# Altium project LED Uygulamasi.PrjPcb
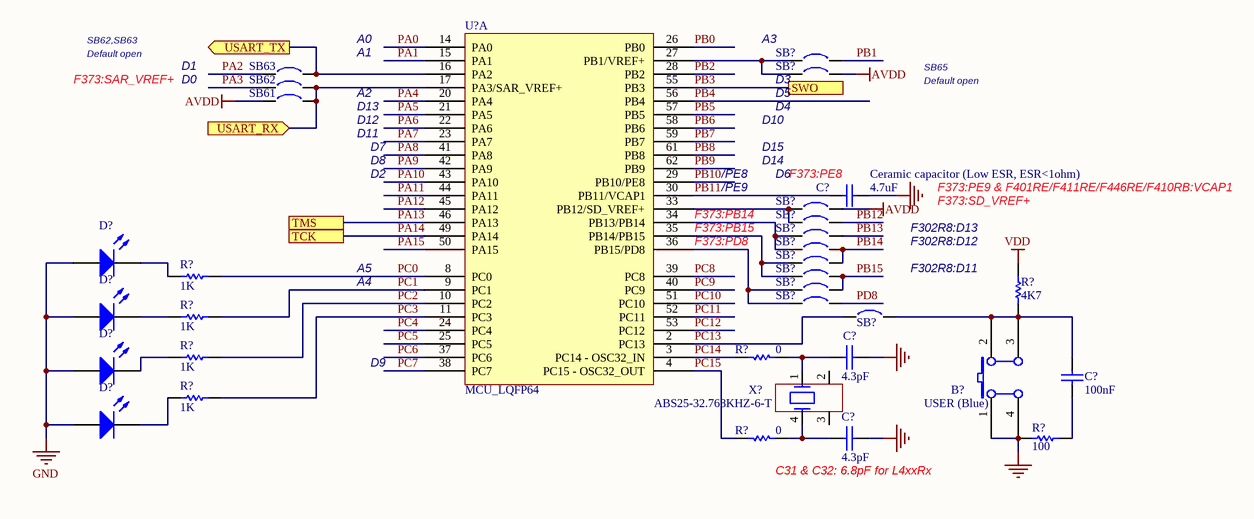
[diagram p0: Sheet1.SchDoc]
1 sheet, 33 parts. Net scope: flat (ports and power ports of the same name join across sheets).

## Sheet Sheet1.SchDoc
size A4; SheetNumber: 1; SheetTotal: 1

### Parts
(Parts that share a designator on the sheet are numbered #1, #2 ... from top to bottom, then left to right.)
B?  USER (Blue)  [PB10]
C?#1  4.7uF  [TAN-A]
C?#2  4.3pF  [0603C]
C?#3  100nF  [RAD-0.3]
C?#4  4.3pF  [0603C]
D?#1  Light-Emitting Diode  (value not drawn)
D?#2  Light-Emitting Diode  (value not drawn)
D?#3  Light-Emitting Diode  (value not drawn)
D?#4  Light-Emitting Diode  (value not drawn)
R?#1  value 1K  (hidden comment: Resistor)
R?#2  4K7  [AXIAL-0.3]
R?#3  value 1K  (hidden comment: Resistor)
R?#4  0  [AXIAL-0.3]
R?#5  value 1K  (hidden comment: Resistor)
R?#6  value 1K  (hidden comment: Resistor)
R?#7  0  [AXIAL-0.3]
R?#8  100  [AXIAL-0.3]
SB61  Circuit Breaker  [JP2_SMD]  (value not drawn)
SB62  Circuit Breaker  [JP2_SMD]  (value not drawn)
SB63  Circuit Breaker  [JP2_SMD]  (value not drawn)
SB?#1  Circuit Breaker  [JP2_SMD]  (value not drawn)
SB?#2  Circuit Breaker  [JP2_SMD]  (value not drawn)
SB?#3  Circuit Breaker  [JP2_SMD]  (value not drawn)
SB?#4  Circuit Breaker  [JP2_SMD]  (value not drawn)
SB?#5  Circuit Breaker  [JP2_SMD]  (value not drawn)
SB?#6  Circuit Breaker  [JP2_SMD]  (value not drawn)
SB?#7  Circuit Breaker  [JP2_SMD]  (value not drawn)
SB?#8  Circuit Breaker  [JP2_SMD]  (value not drawn)
SB?#9  Circuit Breaker  [JP2_SMD]  (value not drawn)
SB?#10  Circuit Breaker  [JP2_SMD]  (value not drawn)
SB?#11  Circuit Breaker  [JP2_SMD]  (value not drawn)
U?  MCU_LQFP64  [LQFP64]  (part A of 2)
X?  ABS25-32.768KHZ-6-T  [XTAL_4SM_8X3R8]

### Ports
SWO, TCK, TMS, USART_RX (in), USART_TX (out)

### Nets
AVDD: SB61.1 SB?#2.2 SB?#3.2
GND: B?.1(A0) B?.4(A1) C?#1.2 C?#2.2 C?#4.2 D?#1.1(A) D?#2.1(A) D?#3.1(A) D?#4.1(A) R?#8.1
VDD: R?#2.2
PA0: U?.14(PA0)
PA1: U?.15(PA1)
PA2: SB63.1
PA3: SB62.1
PA4: U?.20(PA4)
PA5: U?.21(PA5)
PA6: U?.22(PA6)
PA7: U?.23(PA7)
PA8: U?.41(PA8)
PA9: U?.42(PA9)
PA10: U?.43(PA10)
PA11: U?.44(PA11)
PA12: U?.45(PA12)
PA13: U?.46(PA13) ; port TMS
PA14: U?.49(PA14) ; port TCK
PA15: U?.50(PA15)
PB0: U?.26(PB0)
PB1: SB?#1.2
PB2: U?.28(PB2)
PB3: U?.55(PB3) ; port SWO
PB4: U?.56(PB4)
PB5: U?.57(PB5)
PB6: U?.58(PB6)
PB7: U?.59(PB7)
PB8: U?.61(PB8)
PB9: U?.62(PB9)
PB10: U?.29(PB10/PE8)
PB11: C?#1.1 U?.30(PB11/VCAP1)
PB12: SB?#4.2
PB13: SB?#5.2
PB14: SB?#6.2 SB?#7.2
PB15: SB?#8.2 SB?#9.2
PC0: R?#1.2 U?.8(PC0)
PC1: R?#3.2 U?.9(PC1)
PC2: R?#5.2 U?.10(PC2)
PC3: R?#6.2 U?.11(PC3)
PC4: U?.24(PC4)
PC5: U?.25(PC5)
PC6: U?.37(PC6)
PC7: U?.38(PC7)
PC8: U?.39(PC8)
PC9: U?.40(PC9)
PC10: U?.51(PC10)
PC11: U?.52(PC11)
PC12: U?.53(PC12)
PC13: SB?#11.1 U?.2(PC13)
PC14: R?#4.2 U?.3(PC14_-_OSC32_IN)
PC15: R?#7.2 U?.4(PC15_-_OSC32_OUT)
PD8: SB?#10.2
NetB?_2: B?.2(B0) B?.3(B1) C?#3.2 R?#2.1 SB?#11.2
NetC?#2_1: C?#2.1 R?#4.1 X?.1
NetC?#3_1: C?#3.1 R?#8.2
NetC?#4_1: C?#4.1 R?#7.1 X?.4
NetD?#1_2: D?#1.2(K) R?#1.1
NetD?#2_2: D?#2.2(K) R?#3.1
NetD?#3_2: D?#3.2(K) R?#5.1
NetD?#4_2: D?#4.2(K) R?#6.1
NetSB61_2: SB61.2 SB62.2 U?.17(PA3/SAR_VREF+) ; port USART_RX
NetSB63_2: SB63.2 U?.16(PA2) ; port USART_TX
NetSB?#1_1: SB?#1.1 SB?#2.1 U?.27(PB1/VREF+)
NetSB?#3_1: SB?#3.1 SB?#4.1 U?.33(PB12/SD_VREF+)
NetSB?#5_1: SB?#5.1 SB?#6.1 U?.34(PB13/PB14)
NetSB?#7_1: SB?#7.1 SB?#8.1 U?.35(PB14/PB15)
NetSB?#9_1: SB?#9.1 SB?#10.1 U?.36(PB15/PD8)

Not connected (* = marked no-connect by the designer): X? 2 3

### Notes on the sheet
- F373:SAR_VREF+
- Default open
- SB62,SB63
- D0
- D1
- A0
- A1
- (near SB?#1) A3
- (near SB?#2) D3
- SB65
- A2
- D12
- D11
- D13
- D7
- D15
- (near SB?#2) D10
- (near SB?#2) D4
- (near SB?#2) D5
- D2
- D8
- F373:PB14
- /PE9
- /PE8
- (near SB?#3) D14
- (near SB?#3) D6
- (near C?#1) F373:PE8
- (near C?#1) Ceramic capacitor (Low ESR, ESR<1ohm)
- F373:PE9 & F401RE/F411RE/F446RE/F410RB:VCAP1
- F373:SD_VREF+
- A4
- A5
- F373:PB15
- F373:PD8
- F302R8:D12
- F302R8:D11
- F302R8:D13
- D9
- C31 & C32: 6.8pF for L4xxRx

### Library data of the parts
B? = SW PUSHBUTTON: SE PUSHBUTTON
C?#1 = Cap_2.2uF_X7R_10%_0805: Capacitor,4.7uF,25V, X7R,10%,1206,YAGEO; Manuf_Part_1: CC0805KKX7R7BB225; Value: 2.2uF; Revision: July-2002: Re-released for DXP Platform.; Order: CC0805KKX7R7BB225; Manuf_1: YAGEO
C?#2 C?#4 = CAP: Capacitor
C?#3 = CAP: Capacitor; Value: 100pF; Published: 8-Jun-2000; Revision: July-2002: Re-released for DXP Platform.; Publisher: Altium Limited
D?#1-D?#4 = LED: AF: 1; BV: 0; BV_MAX: 1e99; EG: 1.11; FC: 0.5; IBV: 0.001; IS: 1e-14; MJSW: 0.33; NTUN: 30; TNOM: 27; XTI: 3; SimulationGenericComponent: True; CJO: 0; CJP: 0; CTA: 0; CTP: 0; FCS: 0.5; FV_MAX: 1e99; IKF: 0; IKR: 0; ISR: 1e-14; JSW: 0; JTUN: 0; JTUNSW: 0; KEG: 1; KF: 0; LEVEL: 1; N: 1; NBV: 1; NR: 1; NS: 1; PHP: 1; RS: 0; TCV: 0; TLEV: 0; TLEVC: 0; TM1: 0; TM2: 0; TPB: 0; TPHP: 0; TRS: 0; TRS2: 0; TT: 0; TTT1: 0; TTT2: 0; VJ: 1; XTITUN: 3
R?#1 R?#3 R?#5 R?#6 = Resistor: TC1: 0; SimulationGenericComponent: True; TC2: 0
R?#2 = res1: Resistor; Value: 1K; Published: 8-Jun-2000; Revision: July-2002: Re-released for DXP Platform.; Publisher: Altium Limited
R?#4 R?#7 R?#8 = Res1: Resistor; Value: 1K; Published: 8-Jun-2000; Revision: July-2002: Re-released for DXP Platform.; Publisher: Altium Limited
SB61-SB63 SB?#1-SB?#11 = Circuit Breaker: Solder: NO; Published: 24-Mar-1999; Revision: July-2002: Re-released for DXP Platform.; Publisher: Altium Limited
X? = MC306